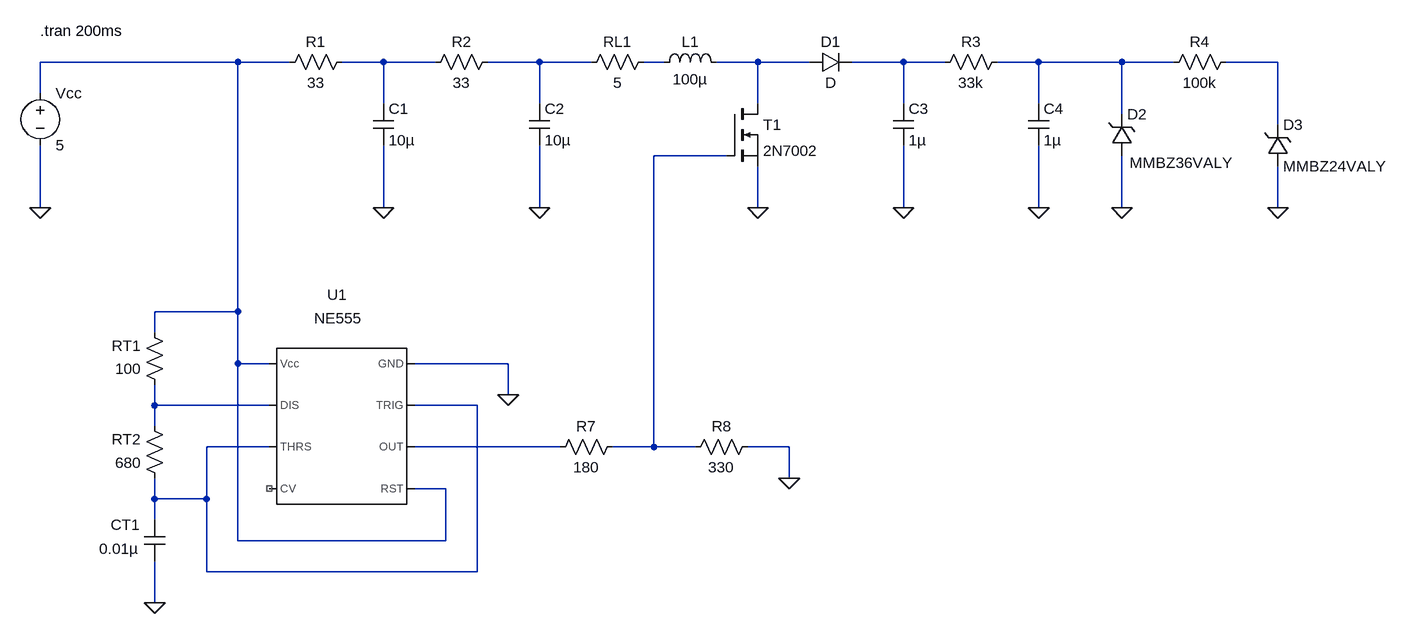
[diagram p0: schematic BoostPump3.asc]
BoostPump3.asc, the LTspice schematic file:
Version 4
SHEET 1 1436 772
WIRE -400 -80 -704 -80
WIRE -320 -80 -400 -80
WIRE -176 -80 -240 -80
WIRE -96 -80 -176 -80
WIRE 64 -80 -16 -80
WIRE 144 -80 64 -80
WIRE 256 -80 224 -80
WIRE 400 -80 336 -80
WIRE 480 -80 400 -80
WIRE 624 -80 544 -80
WIRE 688 -80 624 -80
WIRE 832 -80 768 -80
WIRE 960 -80 832 -80
WIRE 1040 -80 960 -80
WIRE 1200 -80 1120 -80
WIRE -704 -32 -704 -80
WIRE -176 -16 -176 -80
WIRE 64 -16 64 -80
WIRE 400 -16 400 -80
WIRE 624 -16 624 -80
WIRE 832 -16 832 -80
WIRE 960 0 960 -80
WIRE 1200 16 1200 -80
WIRE 352 64 240 64
WIRE -704 144 -704 48
WIRE -176 144 -176 48
WIRE 64 144 64 48
WIRE 400 144 400 80
WIRE 624 144 624 48
WIRE 832 144 832 48
WIRE 960 144 960 64
WIRE 1200 144 1200 80
WIRE -400 304 -400 -80
WIRE -400 304 -528 304
WIRE -528 336 -528 304
WIRE -400 384 -400 304
WIRE -352 384 -400 384
WIRE 16 384 -128 384
WIRE 16 432 16 384
WIRE -528 448 -528 416
WIRE -352 448 -528 448
WIRE -32 448 -128 448
WIRE -528 480 -528 448
WIRE -352 512 -448 512
WIRE 96 512 -128 512
WIRE 240 512 240 64
WIRE 240 512 176 512
WIRE 304 512 240 512
WIRE 448 512 384 512
WIRE 448 560 448 512
WIRE -80 576 -128 576
WIRE -528 592 -528 560
WIRE -448 592 -448 512
WIRE -448 592 -528 592
WIRE -528 624 -528 592
WIRE -400 656 -400 384
WIRE -80 656 -80 576
WIRE -80 656 -400 656
WIRE -448 704 -448 592
WIRE -32 704 -32 448
WIRE -32 704 -448 704
WIRE -528 752 -528 688
FLAG 64 144 0
FLAG 400 144 0
FLAG 624 144 0
FLAG 1200 144 0
FLAG -704 144 0
FLAG 832 144 0
FLAG 960 144 0
FLAG -176 144 0
FLAG -528 752 0
FLAG 16 432 0
FLAG 448 560 0
SYMBOL res 0 -96 R90
WINDOW 0 0 56 VBottom 2
WINDOW 3 32 56 VTop 2
SYMATTR InstName R2
SYMATTR Value 33
SYMBOL res 240 -96 R90
WINDOW 0 0 56 VBottom 2
WINDOW 3 32 56 VTop 2
SYMATTR InstName RL1
SYMATTR Value 5
SYMBOL res 1136 -96 R90
WINDOW 0 0 56 VBottom 2
WINDOW 3 32 56 VTop 2
SYMATTR InstName R4
SYMATTR Value 100k
SYMBOL cap 48 -16 R0
SYMATTR InstName C2
SYMATTR Value 10µ
SYMBOL cap 608 -16 R0
SYMATTR InstName C3
SYMATTR Value 1µ
SYMBOL ind 240 -64 R270
WINDOW 0 32 56 VTop 2
WINDOW 3 5 56 VBottom 2
SYMATTR InstName L1
SYMATTR Value 100µ
SYMBOL diode 480 -64 R270
WINDOW 0 32 32 VTop 2
WINDOW 3 0 32 VBottom 2
SYMATTR InstName D1
SYMBOL nmos 352 -16 R0
SYMATTR InstName T1
SYMATTR Value 2N7002
SYMBOL voltage -704 -48 R0
WINDOW 123 0 0 Left 0
WINDOW 39 0 0 Left 0
SYMATTR InstName Vcc
SYMATTR Value 5
SYMBOL cap 816 -16 R0
SYMATTR InstName C4
SYMATTR Value 1µ
SYMBOL res 784 -96 R90
WINDOW 0 0 56 VBottom 2
WINDOW 3 32 56 VTop 2
SYMATTR InstName R3
SYMATTR Value 33k
SYMBOL zener 1184 80 M180
WINDOW 0 24 64 Left 2
WINDOW 3 24 0 Left 2
SYMATTR InstName D3
SYMATTR Value MMBZ24VALY
SYMBOL zener 944 64 M180
WINDOW 0 24 64 Left 2
WINDOW 3 28 -11 Left 2
SYMATTR InstName D2
SYMATTR Value MMBZ36VALY
SYMBOL cap -192 -16 R0
SYMATTR InstName C1
SYMATTR Value 10µ
SYMBOL res -224 -96 R90
WINDOW 0 0 56 VBottom 2
WINDOW 3 32 56 VTop 2
SYMATTR InstName R1
SYMATTR Value 33
SYMBOL Misc\\NE555 -240 480 M0
WINDOW 0 7 -202 Center 2
WINDOW 3 6 -166 Center 2
SYMATTR InstName U1
SYMBOL cap -544 624 R0
WINDOW 0 -52 8 Left 2
WINDOW 3 -69 45 Left 2
SYMATTR InstName CT1
SYMATTR Value 0.01µ
SYMBOL res -512 576 R180
WINDOW 0 36 76 Left 2
WINDOW 3 36 40 Left 2
SYMATTR InstName RT2
SYMATTR Value 680
SYMBOL res 192 496 R90
WINDOW 0 0 56 VBottom 2
WINDOW 3 32 56 VTop 2
SYMATTR InstName R7
SYMATTR Value 180
SYMBOL res 400 496 R90
WINDOW 0 0 56 VBottom 2
WINDOW 3 32 56 VTop 2
SYMATTR InstName R8
SYMATTR Value 330
SYMBOL res -512 432 R180
WINDOW 0 36 76 Left 2
WINDOW 3 36 40 Left 2
SYMATTR InstName RT1
SYMATTR Value 100
TEXT -704 -128 Left 2 !.tran 200ms

The netlist it stands for:
* BoostPump3.asc
R2 N003 N002 33
RL1 N004 N003 5
R4 N008 N007 100k
C2 N003 0 10µ
C3 N006 0 1µ
L1 N004 N005 100µ
D1 N005 N006 D
M§T1 N005 N009 0 0 2N7002
Vcc N001 0 5
C4 N007 0 1µ
R3 N007 N006 33k
D3 0 N008 MMBZ24VALY
D2 0 N007 MMBZ36VALY
C1 N002 0 10µ
R1 N002 N001 33
XU1 0 N011 N012 N001 NC_01 N011 N010 N001 NE555  ; pins GND TRIG OUT RST CV THRS DIS Vcc
CT1 N011 0 0.01µ
RT2 N011 N010 680
R7 N009 N012 180
R8 0 N009 330
RT1 N010 N001 100
.model D D
.lib standard.dio
.model NMOS NMOS
.model PMOS PMOS
.lib standard.mos
.tran 200ms
.lib NE555.sub
.backanno
.end